# EAGLE schematic SMD IC DC-DC Converters Step-Down XL1509 (EAGLE 9.6.2)
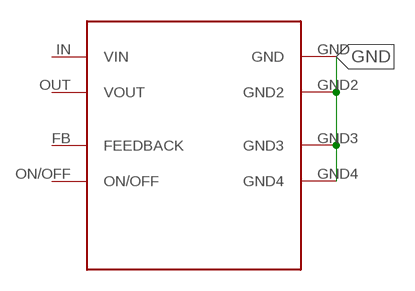
[diagram p0: schematic, sheet 1]

## Parts
U$1  BUCK2A  [BUCK2A]

## Nets
GND: U$1.GND U$1.GND2 U$1.GND3 U$1.GND4
Unconnected: U$1.FB(FEEDBACK) U$1.IN(VIN) U$1.ON/OFF U$1.OUT(VOUT)

## Library data of the parts
U$1 = buck 2a:BUCK2A